# Altium schematic sheet connecteurs.SchDoc: Projet M1 2024
size A4; DrawnBy: J.CLEMENT & D.FOURNIER; DocumentNumber: 2; Revision: V1.0 Rev A; SheetNumber: 7; SheetTotal: 7
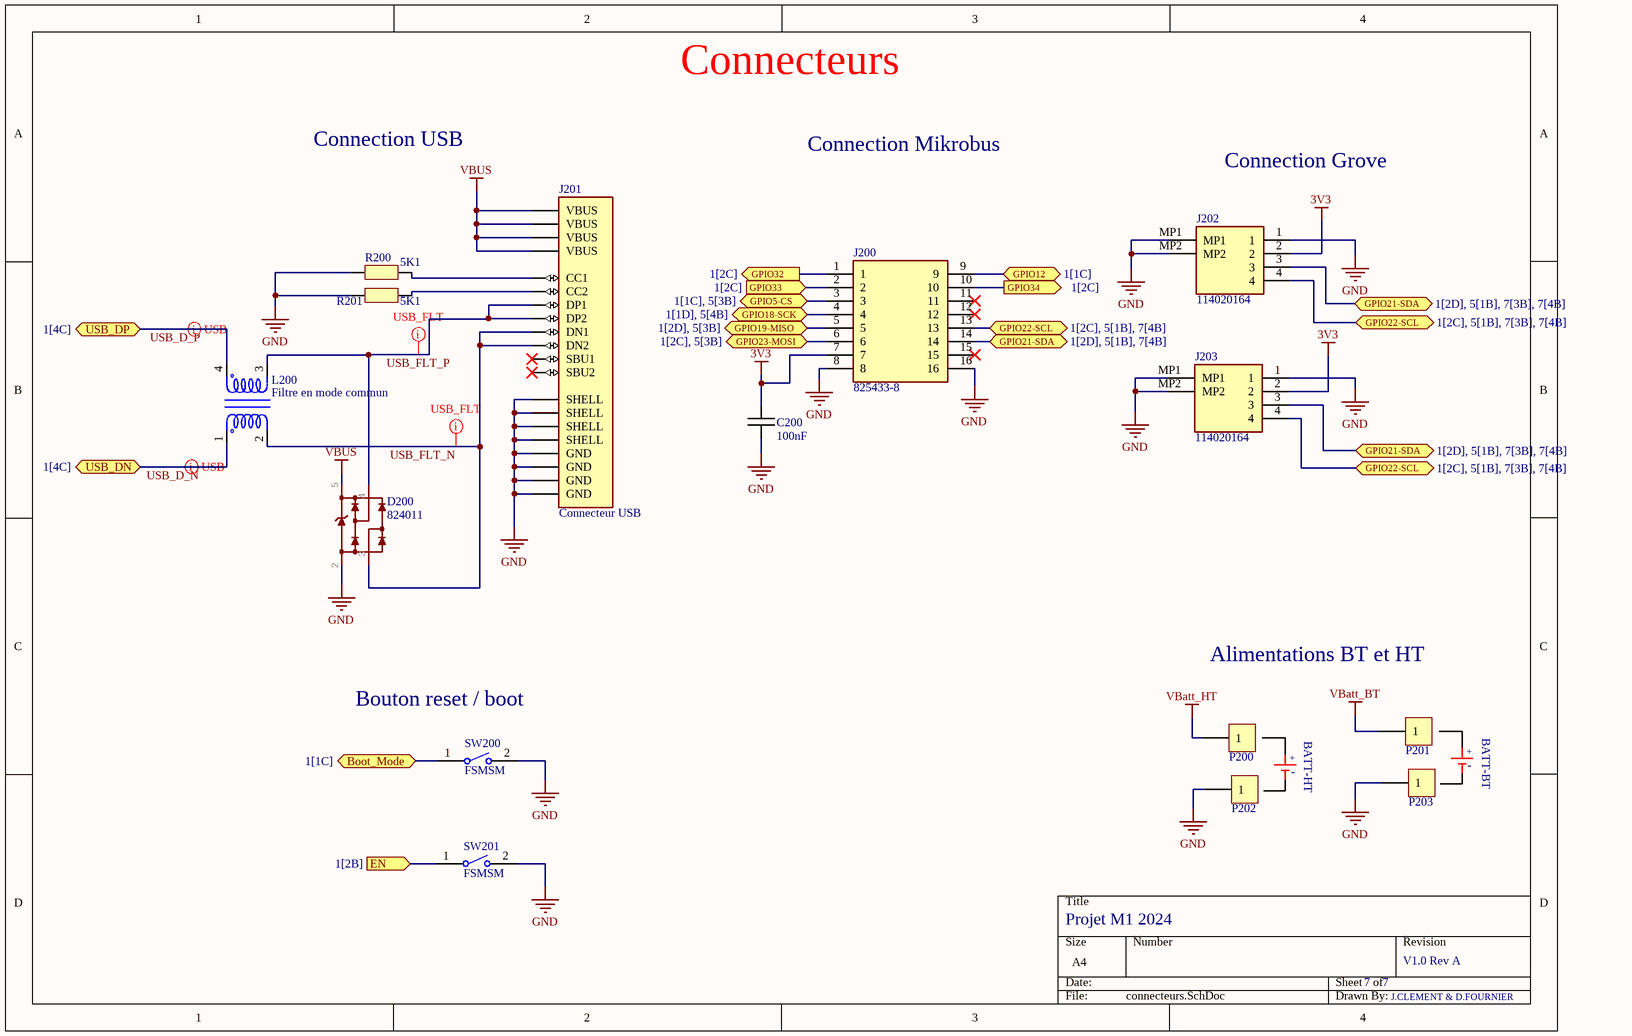
[diagram p0: connecteurs.SchDoc]

## Parts
C200  100nF  [CAPA_0603]
D200  824011  [SOT23-5]
J200  825433-8  [Connect-Mikrobus]
J201  Connecteur USB  [USB4085-GF-A]
J202  114020164  [114020164]
J203  114020164  [114020164]
L200  Filtre en mode commun  [WE-CNSW-1206]
P200  Plage CMS 10x5  [Plage CMS 10x5]  (value not drawn)  (no BOM)
P201  Plage CMS 10x5  [Plage CMS 10x5]  (value not drawn)  (no BOM)
P202  Plage CMS 10x5  [Plage CMS 10x5]  (value not drawn)  (no BOM)
P203  Plage CMS 10x5  [Plage CMS 10x5]  (value not drawn)  (no BOM)
R200  5K1  [RES_0603]
R201  5K1  [RES_0603]
SW200  FSMSM  [TECO-FSMSM-2_V]
SW201  FSMSM  [TECO-FSMSM-2_V]

## Ports
Boot_Mode (bidir, see 1[1C]), EN (in, see 1[2B]), GPIO5-CS (bidir, see 1[1C], 5[3B]), GPIO12 (bidir, see 1[1C]), GPIO18-SCK (bidir, see 1[1D], 5[4B]), GPIO19-MISO (bidir, see 1[2D], 5[3B]), GPIO21-SDA (bidir, see 1[2D], 5[1B], 7[3B], 7[4B]), GPIO21-SDA (bidir, see 1[2D], 5[1B], 7[4B]), GPIO22-SCL (bidir, see 1[2C], 5[1B], 7[3B], 7[4B]), GPIO22-SCL (bidir, see 1[2C], 5[1B], 7[4B]), GPIO23-MOSI (bidir, see 1[2C], 5[3B]), GPIO32 (out, see 1[2C]), GPIO33 (in, see 1[2C]), GPIO34 (out, see 1[2C]), USB_DN (bidir, see 1[4C]), USB_DP (bidir, see 1[4C])

## Nets
3V3: C200.1 J200.7 J202.2 J203.2
GND: C200.2 D200.2(GND) J200.8 J200.16 J201.A1(GND) J201.A12(GND) J201.B1(GND) J201.B12(GND) J201.S1(SHELL) J201.S2(SHELL) J201.S3(SHELL) J201.S4(SHELL) J202.1 J202.MP1 J202.MP2 J203.1 J203.MP1 J203.MP2 P202.1 P203.1 R200.1 R201.1 SW200.2 SW201.2
VBatt_BT: P201.1
VBatt_HT: P200.1
VBUS: D200.5(VDD) J201.A4(VBUS) J201.A9(VBUS) J201.B4(VBUS) J201.B9(VBUS)
Boot_Mode: SW200.1 ; port Boot_Mode
EN: SW201.1 ; port EN
GPIO5-CS: J200.3 ; port GPIO5-CS
GPIO12: J200.9 ; port GPIO12
GPIO18-SCK: J200.4 ; port GPIO18-SCK
GPIO19-MISO: J200.5 ; port GPIO19-MISO
GPIO21-SDA: J200.14 J202.3 J203.3 ; port GPIO21-SDA
GPIO22-SCL: J200.13 J202.4 J203.4 ; port GPIO22-SCL
GPIO23-MOSI: J200.6 ; port GPIO23-MOSI
GPIO32: J200.1 ; port GPIO32
GPIO33: J200.2 ; port GPIO33
GPIO34: J200.10 ; port GPIO34
USB_D_N: L200.1 ; port USB_DN
USB_D_P: L200.4 ; port USB_DP
USB_FLT_N: D200.3 J201.A7(DN1) J201.B7(DN2) L200.2
USB_FLT_P: D200.4 J201.A6(DP1) J201.B6(DP2) L200.3
NetJ201_A5: J201.A5(CC1) R200.2
NetJ201_B5: J201.B5(CC2) R201.2

Not connected (* = marked no-connect by the designer): J200 11* 12* 15*; J201 A8(SBU1)* B8(SBU2)*

## Layout directives
differential pair; rule Differential Pairs Routing [Pref Gap = 0.127mm    Min Gap  = 0.127mm    Max Gap  = 0.127mmPref Width = 0.22mm    Min Width  = 0.136mm    Max Width  = 0.22mm]: USB_D_N, USB_D_P, USB_FLT_N, USB_FLT_P

## Notes on the sheet
- Connecteurs
- Connection USB
- Connection Mikrobus
- Connection Grove
- (near SW200) Bouton reset / boot
- Alimentations BT et HT
- +
- -
- BATT-HT
- BATT-BT

## Library data of the parts
C200 = Capacitor
D200 = 824011: TVS Diode Array WE-TVS, High Speed Series  - Low capazity - No leakage current - Low clamping voltage - high ESD voltage protection  -- USB 1.0 - 2.0
J200 = Connect-Mikrobus: Headers & Wire Housings 8P double for connection mikrobus; Manufacturer_Name: TE Connectivity; Manufacturer_Part_Number: 825433-8; Mouser Part Number: 571-825433-8
J201 = USB4085-GF-A: Connecteurs USB USB Type C, 2.0, Rec, TH , G/F, RA , Top Mnt, T & R
J202 J203 = 114020164: Seeed Studio Accessories Grove Female Header - SMD-4P-2.0mm-90D-20Pcs; Manufacturer_Name: Seeed Studio; Manufacturer_Part_Number: 114020164; Mouser Part Number: 713-114020164
L200 = 744232090: Bobines / filtres en mode commun WE-CNSW 1206 370mA 90Ohm 100MHz AECQ200
P200-P203 = Plage CMS 10x5_1: Plage de report CMS 10x5mm; PN: L30; Value: Plage CMS 10x5; Footprint_statut: ok
R200 R201 = Resistor
SW200 SW201 = CMP-2000-07511-1: FSMSM Push Button Switch, 50 mA, -35 to 85 degC, 2-Pin SMD, RoHS, Bulk; Manufacturer: TE Connectivity; Actuator Length: 1.07mm; Electrical Life: 20000Cycles; Actuator Material: Polyamide; Current Rating: 50mA; Illumination Type: Illuminated; Voltage Rating (DC): 24V; Contact Resistance: 100mOhm; Case\/Package: SMD/SMT; Operating Force: 180gf; Switch Travel: 0.25mm; Max Voltage Rating (DC): 12V; Throw Configuration: SPST; Packaging: LoosePiece; Max Operating Temperature: 85degC; ELV: Compliant; Package Description: 2-Pin Surface Mount Device, Body 6 x 3.5 mm, Pitch 9.19 mm; RoHSCompliant: true; Manufacturer URL: http://www.te.com/; Contact Plating: Silver; Contact Material: Brass; Mounting Technology: SurfaceMount; Contact Current Rating: 50mA; Datasheet Version: Rev. C2, 08/2014; Datasheet URL: http://www.te.com/commerce/DocumentDelivery/DDEController?Action=showdoc&DocId=Customer+Drawing%7F1437566-3%7FC2%7Fpdf%7FEnglish%7FENG_CD_1437566-3_C2_1437566_3_1_c.dwg.pdf%7F1437566-3; Mechanical Life: 20000Cycles; Package Reference: FSMSM; REACH SVHC: Unknown; Orientation: Straight; Min Operating Temperature: -35degC; Lead Free: LeadFree; Termination: GullWing; Package Quantity: 1000; Mount: SurfaceMount